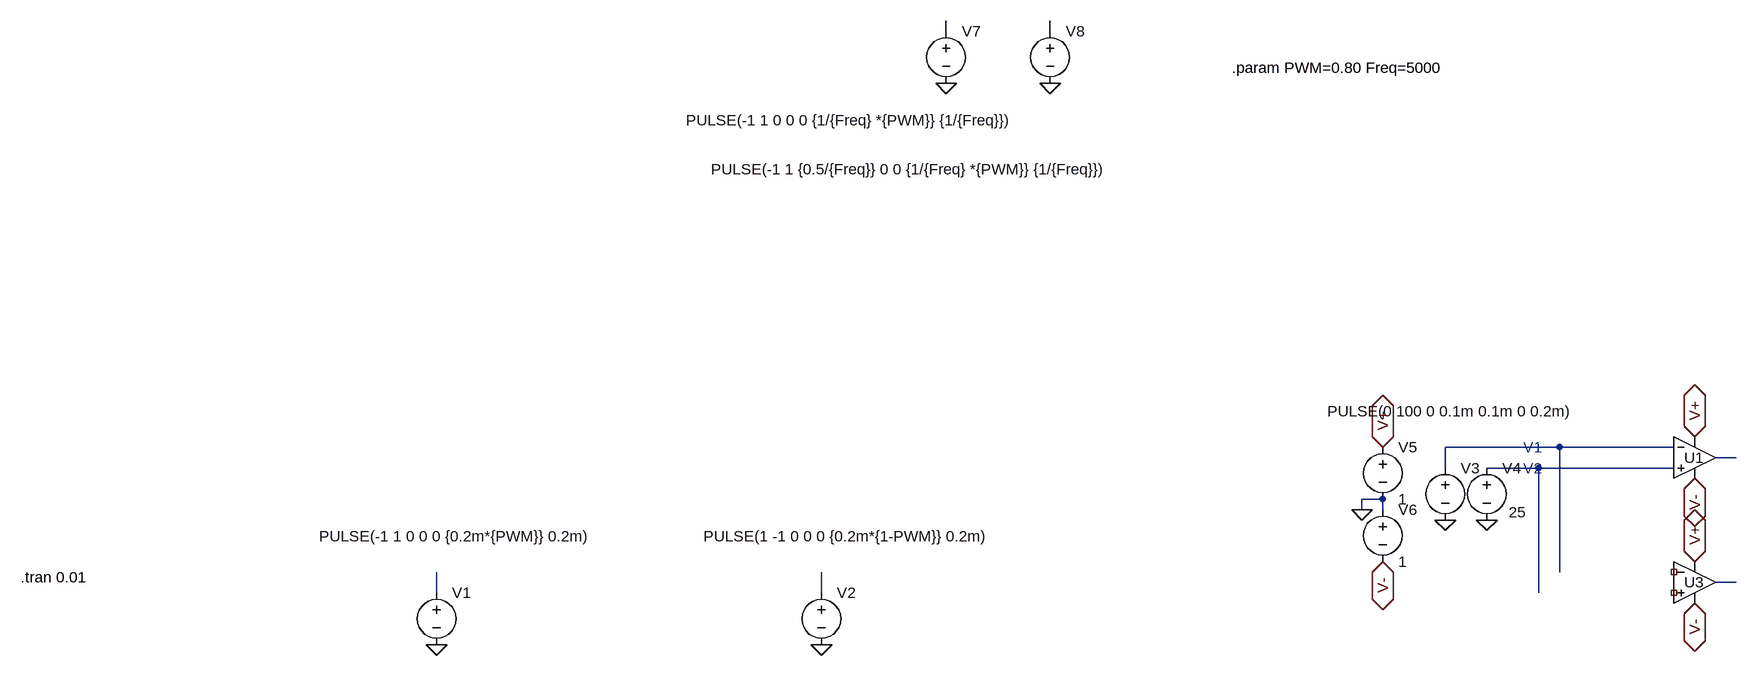
[diagram p0: schematic PWMGenerationforBoostconverterD.asc]
PWMGenerationforBoostconverterD.asc, the LTspice schematic file:
Version 4
SHEET 1 2104 680
WIRE 752 -688 752 -704
WIRE 912 -688 912 -704
WIRE 1696 -48 1520 -48
WIRE 1872 -48 1696 -48
WIRE 1968 -32 1936 -32
WIRE 1520 -16 1520 -48
WIRE 1664 -16 1584 -16
WIRE 1872 -16 1664 -16
WIRE 1424 32 1392 32
WIRE 1392 48 1392 32
WIRE 1424 48 1424 32
WIRE 1696 144 1696 -48
WIRE 1968 160 1936 160
WIRE -32 176 -32 144
WIRE 560 176 560 144
WIRE 1664 176 1664 -16
FLAG -32 256 0
FLAG 560 256 0
FLAG 1520 64 0
FLAG 1584 64 0
FLAG 1392 48 0
FLAG 1904 -64 V+
IOPIN 1904 -64 BiDir
FLAG 1424 -48 V+
IOPIN 1424 -48 BiDir
FLAG 1424 128 V-
IOPIN 1424 128 BiDir
FLAG 1904 0 V-
IOPIN 1904 0 BiDir
FLAG 1904 128 V+
IOPIN 1904 128 BiDir
FLAG 1904 192 V-
IOPIN 1904 192 BiDir
FLAG 752 -608 0
FLAG 912 -608 0
SYMBOL voltage -32 160 R0
WINDOW 3 -181 -71 Left 2
WINDOW 123 0 0 Left 2
WINDOW 39 0 0 Left 2
SYMATTR Value PULSE(-1 1 0 0 0 {0.2m*{PWM}} 0.2m)
SYMATTR InstName V1
SYMBOL voltage 560 160 R0
WINDOW 3 -181 -71 Left 2
WINDOW 123 0 0 Left 2
WINDOW 39 0 0 Left 2
SYMATTR Value PULSE(1 -1 0 0 0 {0.2m*{1-PWM}} 0.2m)
SYMATTR InstName V2
SYMBOL Opamps\\UniversalOpamp2 1904 -32 R0
WINDOW 0 -16 0 Left 2
SYMATTR InstName U1
SYMBOL voltage 1520 -32 R0
WINDOW 3 -181 -71 Left 2
WINDOW 123 0 0 Left 2
WINDOW 39 0 0 Left 2
SYMATTR Value PULSE(0 100 0 0.1m 0.1m 0 0.2m)
SYMATTR InstName V3
SYMBOL voltage 1584 -32 R0
WINDOW 123 0 0 Left 2
WINDOW 39 0 0 Left 2
WINDOW 3 34 84 Left 2
SYMATTR Value 25
SYMATTR InstName V4
SYMBOL voltage 1424 -64 R0
WINDOW 123 0 0 Left 2
WINDOW 39 0 0 Left 2
SYMATTR InstName V5
SYMATTR Value 1
SYMBOL voltage 1424 32 R0
WINDOW 123 0 0 Left 2
WINDOW 39 0 0 Left 2
SYMATTR InstName V6
SYMATTR Value 1
SYMBOL Opamps\\UniversalOpamp2 1904 160 R0
WINDOW 0 -16 0 Left 2
SYMATTR InstName U3
SYMBOL voltage 752 -704 R0
WINDOW 3 -400 153 Left 2
WINDOW 123 0 0 Left 2
WINDOW 39 0 0 Left 2
SYMATTR Value PULSE(-1 1 0 0 0 {1/{Freq} *{PWM}} {1/{Freq}})
SYMATTR InstName V7
SYMBOL voltage 912 -704 R0
WINDOW 3 -522 228 Left 2
WINDOW 123 0 0 Left 2
WINDOW 39 0 0 Left 2
SYMATTR Value PULSE(-1 1 {0.5/{Freq}} 0 0 {1/{Freq} *{PWM}} {1/{Freq}})
SYMATTR InstName V8
TEXT -672 152 Left 2 !.tran 0.01
TEXT 1192 -632 Left 2 !.param PWM=0.80 Freq=5000
TEXT 1640 -48 Left 2 ;V1
TEXT 1640 -16 Left 2 ;V2

The netlist it stands for:
* PWMGenerationforBoostconverterD.asc
V1 N007 0 PULSE(-1 1 0 0 0 {0.2m*{PWM}} 0.2m)
V2 N008 0 PULSE(1 -1 0 0 0 {0.2m*{1-PWM}} 0.2m)
XU1 N005 N003 V+ V- N004 level.2 Avol=1Meg GBW=10Meg Slew=10Meg ilimit=25m rail=0 Vos=0 phimargin=45 en=0 enk=0 in=0 ink=0 Rin=500Meg  ; pins IN+ IN- V+ V- OUT
V3 N003 0 PULSE(0 100 0 0.1m 0.1m 0 0.2m)
V4 N005 0 25
V5 V+ 0 1
V6 0 V- 1
XU3 NC_01 NC_02 V+ V- N006 level.2 Avol=1Meg GBW=10Meg Slew=10Meg ilimit=25m rail=0 Vos=0 phimargin=45 en=0 enk=0 in=0 ink=0 Rin=500Meg  ; pins IN+ IN- V+ V- OUT
V7 N001 0 PULSE(-1 1 0 0 0 {1/{Freq} *{PWM}} {1/{Freq}})
V8 N002 0 PULSE(-1 1 {0.5/{Freq}} 0 0 {1/{Freq} *{PWM}} {1/{Freq}})
.tran 0.01
.param PWM=0.80 Freq=5000
* V1
* V2
.lib UniversalOpamps2.sub
.backanno
.end